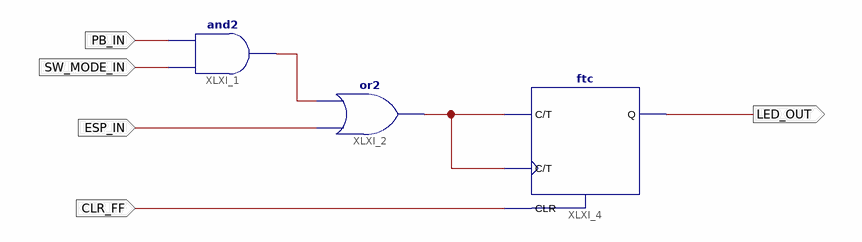
[diagram p0: schematic sheet 1]
// Xilinx ISE schematic Regular_LED.sch (spartan6) as structural Verilog: 3 symbols, 5 ports
module Regular_LED (
  input  ESP_IN,
  input  SW_MODE_IN,
  input  PB_IN,
  input  CLR_FF,
  output LED_OUT
);

  wire XLXN_1, XLXN_14;

  and XLXI_1 (XLXN_1, SW_MODE_IN, PB_IN);
  or XLXI_2 (XLXN_14, ESP_IN, XLXN_1);
  ftc XLXI_4 (.C(XLXN_14), .CLR(CLR_FF), .T(XLXN_14), .Q(LED_OUT));
endmodule
